# Altium schematic sheet Mainboard_Breakbeam_Interface.SchDoc
size A4
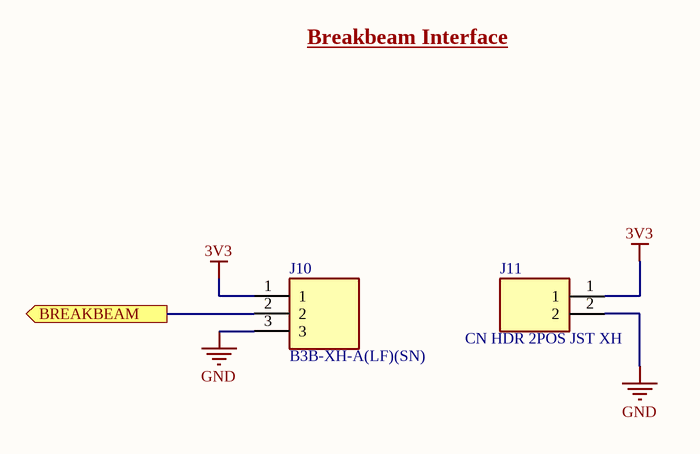
[diagram p0: Mainboard_Breakbeam_Interface.SchDoc]

## Parts
J10  B3B-XH-A(LF)(SN)  [JST_B3B-XH-A(LF)(SN)]
J11  CN HDR 2POS JST XH  [JST_B2B-XH-A(LF)(SN)]

## Ports
BREAKBEAM (out)

## Nets
3V3: J10.1 J11.1
GND: J10.3 J11.2
BREAKBEAM: J10.2 ; port BREAKBEAM

## Notes on the sheet
- Breakbeam Interface

## Library data of the parts
J10 = CN 3POS TH JSTXH: CN 3POS TH JST XH; MF: JST Sales; Package: None; SnapEDA_Link: https://www.snapeda.com/parts/B3B-XH-A(LF)(SN)/JST%20Sales%20America%20Inc./view-part/231271/?ref=snap; DigiKey-Purchase-URL: https://snapeda.com/shop?store=DigiKey&id=231271; MP: B3B-XH-A(LF)(SN); Price: None; Availability: Warning; Value: *
J11 = CN HDR 2POS JST XH: Connector Header Through Hole 2 position 0.098 _2.50mm_ / JST XH; MP: B2B-XH-A_LF__SN_; MF: JST Sales; Price: None; Package: None; Value: *; Availability: Unavailable; SnapEDA_Link: https://www.snapeda.com/parts/B2B-XH-A%28LF%29%28SN%29/JST%20Sales%20America%20Inc./view-part/492310/?ref=snap